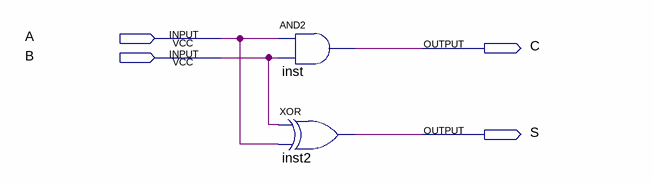
[diagram p0: schematic sheet]
// Quartus schematic ha.bdf as structural Verilog: 2 symbols, 4 pins
module ha (
  input  A,
  input  B,
  output C,
  output S
);

  and inst (C, A, B);
  xor inst2 (S, B, A);
endmodule
